# EAGLE design SeniorProjectBoard5 (EAGLE 8.3.2)
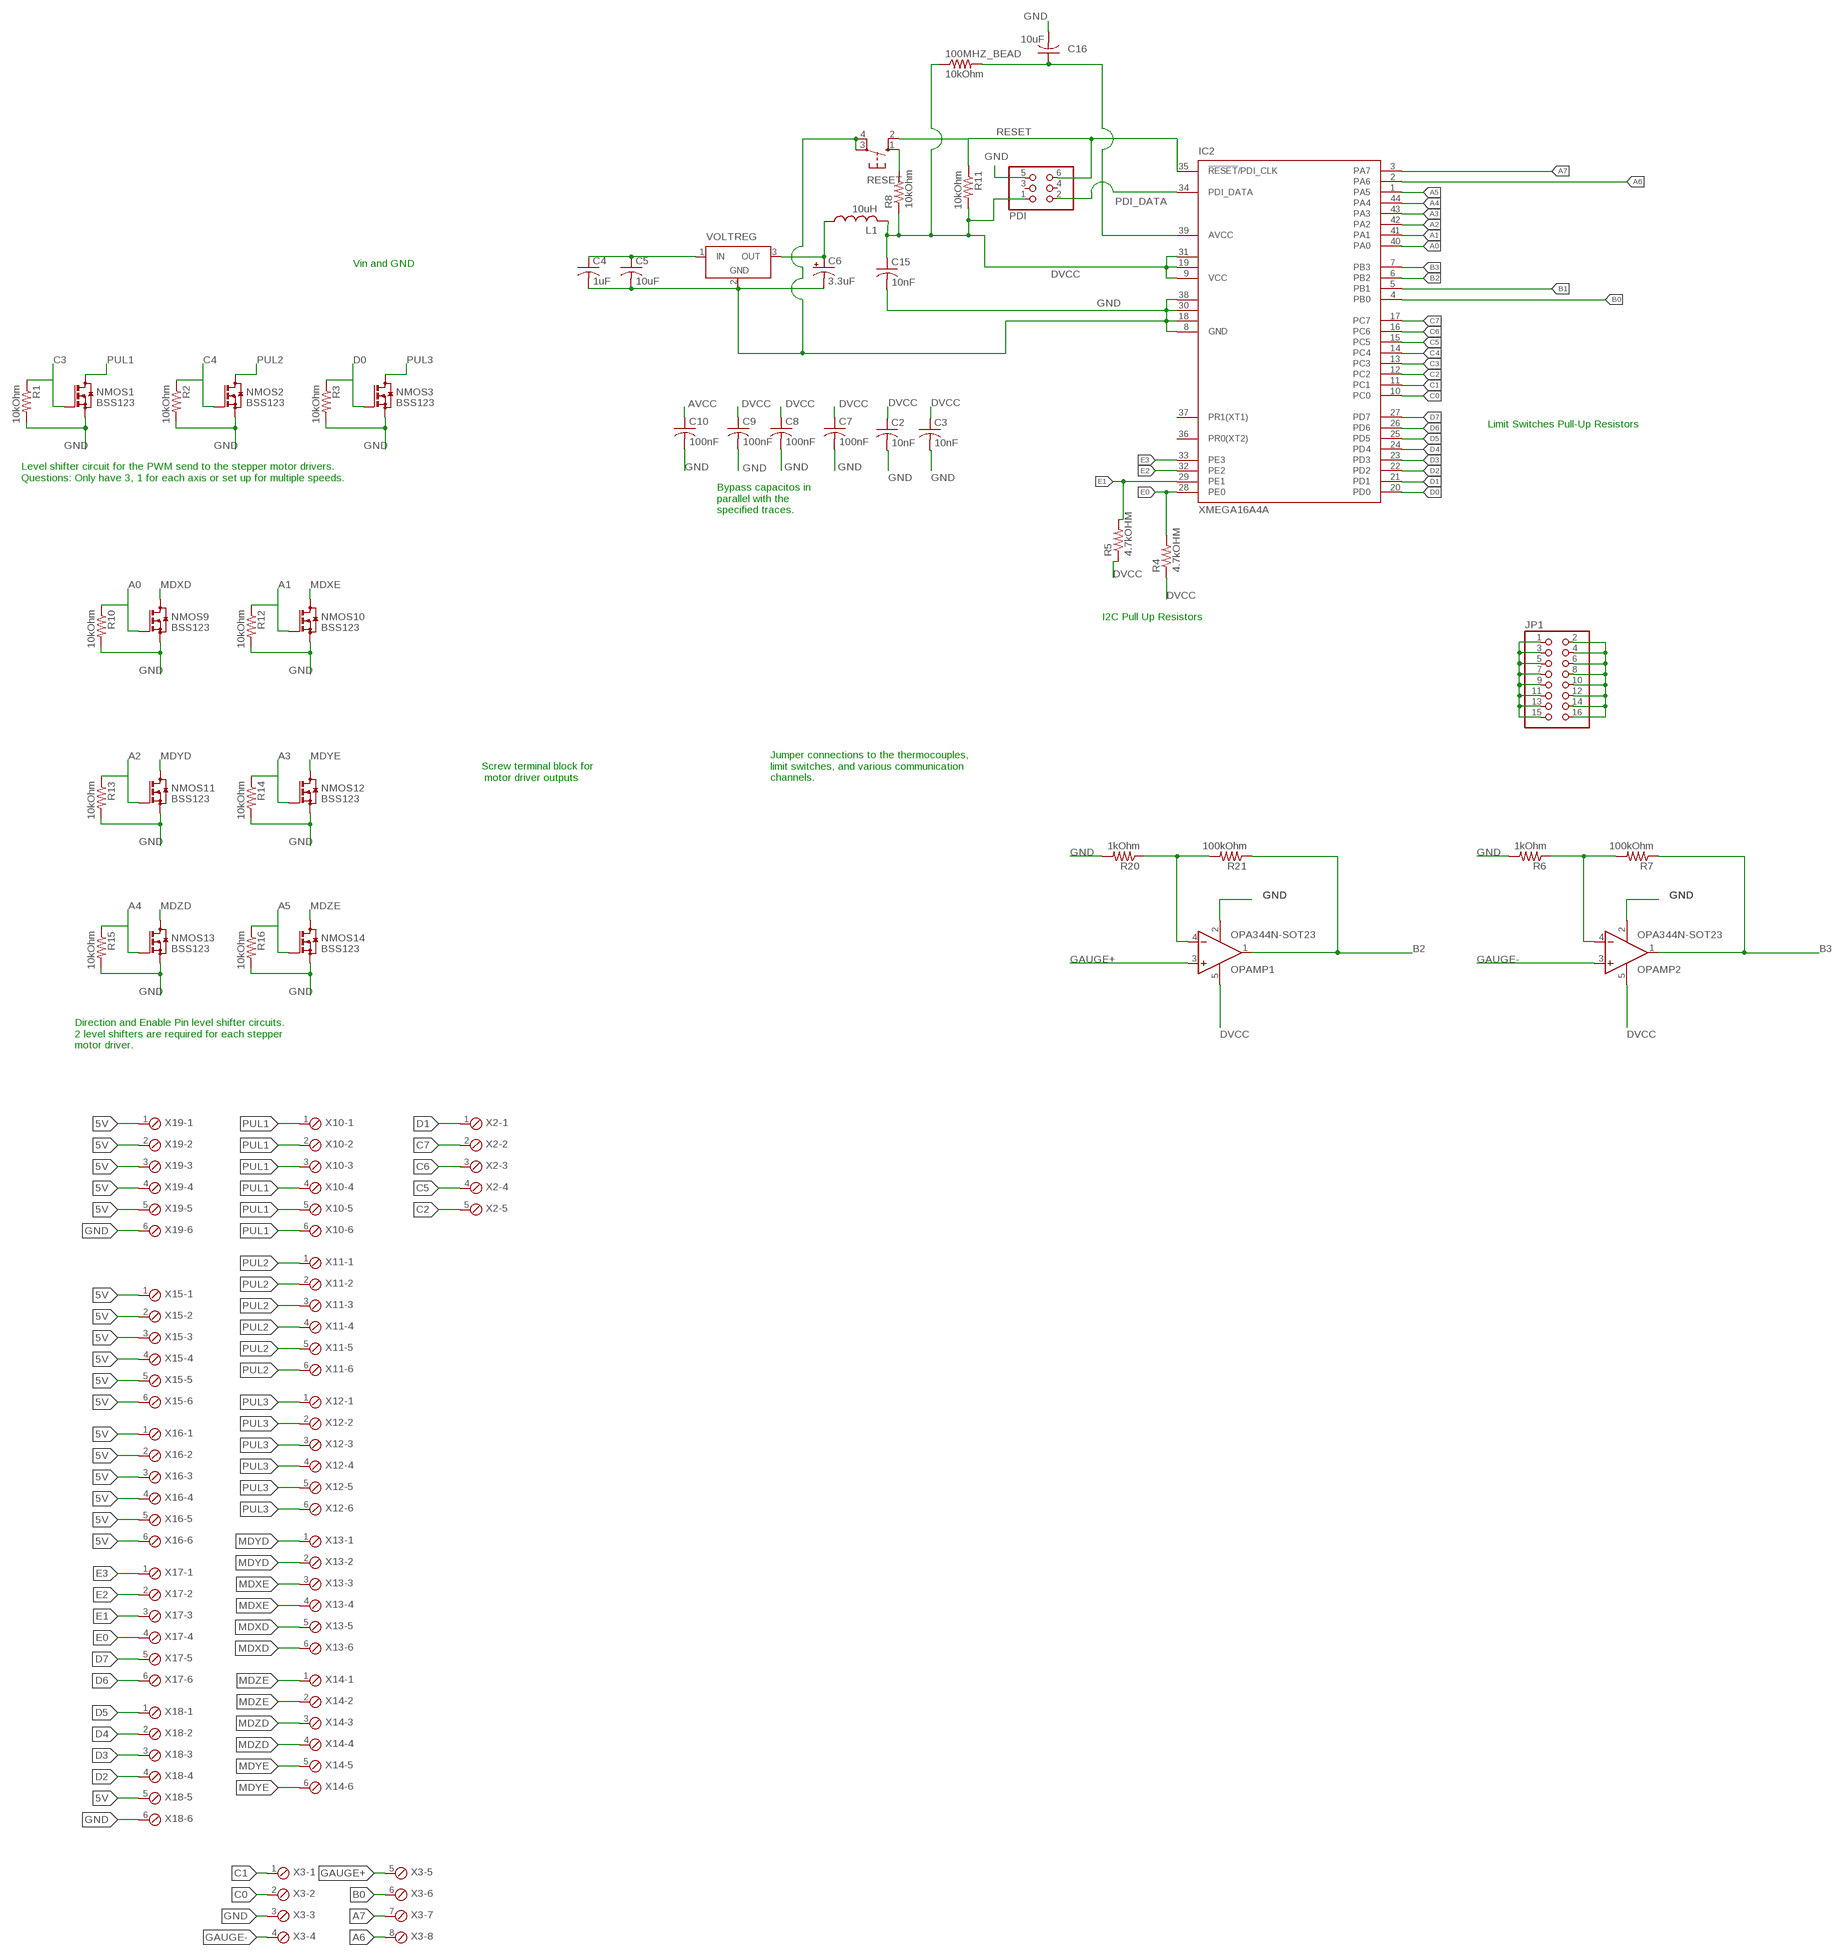
[diagram p0: schematic, sheet 1]

## Parts
100MHZ_BEAD  10kOhm  R-US_R0805  [R0805]
C2  10nF  C-USC0805  [C0805]
C3  10nF  C-USC0805  [C0805]
C4  1uF  C-USC0805  [C0805]
C5  10uF  C-USC0805  [C0805]
C6  3.3uF  CPOL-USCT3216  [CT3216]
C7  100nF  C-USC0805  [C0805]
C8  100nF  C-USC0805  [C0805]
C9  100nF  C-USC0805  [C0805]
C10  100nF  C-USC0805  [C0805]
C15  10nF  C-USC0805  [C0805]
C16  10uF  C-USC0805  [C0805]
IC2  XMEGA16A4A  [TQFP44]
JP1  PINHD-2X8  [2X08]
L1  10uH  L-USL1812  [L1812]
NMOS1  BSS123  [SOT23]
NMOS2  BSS123  [SOT23]
NMOS3  BSS123  [SOT23]
NMOS9  BSS123  [SOT23]
NMOS10  BSS123  [SOT23]
NMOS11  BSS123  [SOT23]
NMOS12  BSS123  [SOT23]
NMOS13  BSS123  [SOT23]
NMOS14  BSS123  [SOT23]
OPAMP1  OPA344N-SOT23  [SOT23-5]
OPAMP2  OPA344N-SOT23  [SOT23-5]
PDI  PINHD-2X3  [2X03]
R1  10kOhm  R-US_R0805  [R0805]
R2  10kOhm  R-US_R0805  [R0805]
R3  10kOhm  R-US_R0805  [R0805]
R4  4.7kOHM  R-US_R0805  [R0805]
R5  4.7kOHM  R-US_R0805  [R0805]
R6  1kOhm  R-US_R0805  [R0805]
R7  100kOhm  R-US_R0805  [R0805]
R8  10kOhm  R-US_R0805  [R0805]
R10  10kOhm  R-US_R0805  [R0805]
R11  10kOhm  R-US_R0805  [R0805]
R12  10kOhm  R-US_R0805  [R0805]
R13  10kOhm  R-US_R0805  [R0805]
R14  10kOhm  R-US_R0805  [R0805]
R15  10kOhm  R-US_R0805  [R0805]
R16  10kOhm  R-US_R0805  [R0805]
R20  1kOhm  R-US_R0805  [R0805]
R21  100kOhm  R-US_R0805  [R0805]
RESET  10-XX  [B3F-10XX]
VOLTREG  LT1129CST5  [SOT223]
X2  MPT5  [5POL254]
X3  MPT8  [8POL254]
X10  MPT6  [6POL254]
X11  MPT6  [6POL254]
X12  MPT6  [6POL254]
X13  MPT6  [6POL254]
X14  MPT6  [6POL254]
X15  MPT6  [6POL254]
X16  MPT6  [6POL254]
X17  MPT6  [6POL254]
X18  MPT6  [6POL254]
X19  MPT6  [6POL254]

## Nets
5V: C4.1 C5.1 VOLTREG.1(IN) X15.1 X15.2 X15.3 X15.4 X15.5 X15.6 X16.1 X16.2 X16.3 X16.4 X16.5 X16.6 X18.5 X19.1 X19.2 X19.3 X19.4 X19.5
A0: IC2.40(PA0) NMOS9.1(G) R10.1
A1: IC2.41(PA1) NMOS10.1(G) R12.1
A2: IC2.42(PA2) NMOS11.1(G) R13.1
A3: IC2.43(PA3) NMOS12.1(G) R14.1
A4: IC2.44(PA4) NMOS13.1(G) R15.1
A5: IC2.1(PA5) NMOS14.1(G) R16.1
A6: IC2.2(PA6) X3.8
A7: IC2.3(PA7) X3.7
AVCC: 100MHZ_BEAD.2 C10.1 C16.1 IC2.39(AVCC)
B0: IC2.4(PB0) X3.6
B1: IC2.5(PB1)
B2: IC2.6(PB2) OPAMP1.1(OUT) R21.1
B3: IC2.7(PB3) OPAMP2.1(OUT) R7.1
C0: IC2.10(PC0) X3.2
C1: IC2.11(PC1) X3.1
C2: IC2.12(PC2) X2.5
C3: IC2.13(PC3) NMOS1.1(G) R1.1
C4: IC2.14(PC4) NMOS2.1(G) R2.1
C5: IC2.15(PC5) X2.4
C6: IC2.16(PC6) X2.3
C7: IC2.17(PC7) X2.2
D0: IC2.20(PD0) NMOS3.1(G) R3.1
D1: IC2.21(PD1) X2.1
D2: IC2.22(PD2) X18.4
D3: IC2.23(PD3) X18.3
D4: IC2.24(PD4) X18.2
D5: IC2.25(PD5) X18.1
D6: IC2.26(PD6) X17.6
D7: IC2.27(PD7) X17.5
DVCC: 100MHZ_BEAD.1 C2.1 C3.1 C7.1 C8.1 C9.1 C15.1 IC2.9(VCC) IC2.19(VCC1) IC2.31(VCC2) JP1.1 JP1.3 JP1.5 JP1.7 JP1.9 JP1.11 JP1.13 JP1.15 L1.2 OPAMP1.5(V+) OPAMP2.5(V+) PDI.1 R4.1 R5.1 R8.1 R11.2
E0: IC2.28(PE0) R4.2 X17.4
E1: IC2.29(PE1) R5.2 X17.3
E2: IC2.32(PE2) X17.2
E3: IC2.33(PE3) X17.1
GAUGE+: OPAMP1.3(+IN) X3.5
GAUGE-: OPAMP2.3(+IN) X3.4
GND: C2.2 C3.2 C4.2 C5.2 C6.- C7.2 C8.2 C9.2 C10.2 C15.2 C16.2 IC2.8(GND) IC2.18(GND1) IC2.30(GND2) IC2.38(GND3) JP1.2 JP1.4 JP1.6 JP1.8 JP1.10 JP1.12 JP1.14 JP1.16 NMOS1.2(S) NMOS2.2(S) NMOS3.2(S) NMOS9.2(S) NMOS10.2(S) NMOS11.2(S) NMOS12.2(S) NMOS13.2(S) NMOS14.2(S) OPAMP1.2(V-) OPAMP2.2(V-) PDI.5 R1.2 R2.2 R3.2 R6.2 R10.2 R12.2 R13.2 R14.2 R15.2 R16.2 R20.2 RESET.3(P) RESET.4(P1) VOLTREG.2(GND) X3.3 X18.6 X19.6
MDXD: NMOS9.3(D) X13.5 X13.6
MDXE: NMOS10.3(D) X13.3 X13.4
MDYD: NMOS11.3(D) X13.1 X13.2
MDYE: NMOS12.3(D) X14.5 X14.6
MDZD: NMOS13.3(D) X14.3 X14.4
MDZE: NMOS14.3(D) X14.1 X14.2
N$1: OPAMP2.4(-IN) R6.1 R7.2
N$47: OPAMP1.4(-IN) R20.1 R21.2
PDI_DATA: IC2.34(PDI_DATA) PDI.2
PUL1: NMOS1.3(D) X10.1 X10.2 X10.3 X10.4 X10.5 X10.6
PUL2: NMOS2.3(D) X11.1 X11.2 X11.3 X11.4 X11.5 X11.6
PUL3: NMOS3.3(D) X12.1 X12.2 X12.3 X12.4 X12.5 X12.6
RESET: IC2.35(!RESET!/PDI_CLK) PDI.6 R11.1 RESET.2(S1)
SW_PULLUP: R8.2 RESET.1(S)
V_REG_OUT: C6.+ L1.1 VOLTREG.3(OUT)
Unconnected: IC2.36(PR0(XT2)) IC2.37(PR1(XT1)) PDI.3 PDI.4

## Notes on the sheet
- Vin and GND
- Limit Switches Pull-Up Resistors
- Level shifter circuit for the PWM send to the stepper motor drivers. 
  Questions: Only have 3, 1 for each axis or set up for multiple speeds.
- Bypass capacitos in
  parallel with the 
  specified traces.
- I2C Pull Up Resistors
- Screw terminal block for
   motor driver outputs
- Jumper connections to the thermocouples,
  limit switches, and various communication 
  channels.
- Direction and Enable Pin level shifter circuits.
  2 level shifters are required for each stepper
  motor driver.

## Power pins joined to a net without a drawn wire
GND: VOLTREG.4(GND)

## Library data of the parts
100MHZ_BEAD R1-R8 R10-R16 R20 R21 = rcl:R-US_: RESISTOR, American symbol
C2-C5 C7-C10 C15 C16 = rcl:C-US: CAPACITOR, American symbol
C6 = rcl:CPOL-US: POLARIZED CAPACITOR, American symbol
IC2 = atmel:XMEGA16A4: MICROCONTROLLER Features High-performance, Low-power 8/16-bit AVR XMEGA Microcontroller Non-Volatile Program and Data Memories - 16 KB - 128 KB of In-System Self-Programmable Flash - 4 KB - 8 KB Boot Code Section with Independent Lock Bits - 1 KB - 2 KB EEPROM - 2 KB - 8 KB Internal SRAM Peripheral Features - Four-channel DMA Controller with support for external requests - Eight-channel Event System - Five 16-bit Timer/Counters Three Timer/Counters with 4 Output Compare or Input Capture channels Two Timer/Counters with 2 Output Compare or Input Capture channels High-Resolution Extensions on all Timer/Counters Advanced Waveform Extension on one Timer/Counter - Five USARTs IrDA Extension on one USART - Two Two-Wire Interfaces with dual address match (I2C and SMBus compatible) - Two SPIs (Serial Peripheral Interfaces) peripherals - AES and DES Crypto Engine - 16-bit Real Time Counter with Separate Oscillator - One Twelve-channel, 12-bit, 2 Msps Analog to Digital Converter - One Two-channel, 12-bit, 1 Msps Digital to Analog Converter - Two Analog Comparators with Window compare function - External Interrupts on all General Purpose I/O pins - Programmable Watchdog Timer with Separate On-chip Ultra Low Power Oscillator Special Microcontroller Features - Power-on Reset and Programmable Brown-out Detection - Internal and External Clock Options with PLL - Programmable Multi-level Interrupt Controller - Sleep Modes: Idle, Power-down, Standby, Power-save, Extended Standby - Advanced Programming, Test and Debugging Interfaces PDI (Program and Debug Interface) for programming, test and debugging I/O and Packages - 34 Programmable I/O Lines - 44 - lead TQFP - 44 - pad VQFN/QFN - 49 - ball VFBGA Operating Voltage - 1.6 - 3.6V Speed performance - 0 - 12 MHz @ 1.6 - 3.6V - 0 - 32 MHz @ 2.7 - 3.6V Drawn by Dipl.-Ing. (FH) Robert Siegler Created: 27.05.09; OC_FARNELL: unknown; OC_NEWARK: unknown
JP1 = pinhead:PINHD-2X8: PIN HEADER
L1 = rcl:L-US: INDUCTOR, American symbol
NMOS1-NMOS3 NMOS9-NMOS14 = transistor-small-signal:BSS123: N-CHANNEL MOS FET
OPAMP1 OPAMP2 = linear:OPA*-SOT23: Single Operational Amplifier Low Power, Single-Supply, Rail-To-Rail Operational Amplifier Source: http://focus.ti.com/lit/ds/symlink/opa2345.pdf
PDI = pinhead:PINHD-2X3: PIN HEADER
RESET = switch-omron:10-XX: OMRON SWITCH; MPN: B3F-1000; OC_FARNELL: 176432; OC_NEWARK: 36M3542
VOLTREG = linear-technology:LT1129CST5: VOLTAGE REGULATOR with shutdown; MPN: LT1129CST-5#PBF; OC_FARNELL: 1663375; OC_NEWARK: 57M2069
X2 = con-phoenix-254:MPT5: PHOENIX CONNECTOR; OC_FARNELL: unknown; OC_NEWARK: unknown
X3 = con-phoenix-254:MPT8: PHOENIX CONNECTOR; OC_FARNELL: unknown; OC_NEWARK: unknown
X10-X19 = con-phoenix-254:MPT6: PHOENIX CONNECTOR; OC_FARNELL: unknown; OC_NEWARK: unknown

## Board
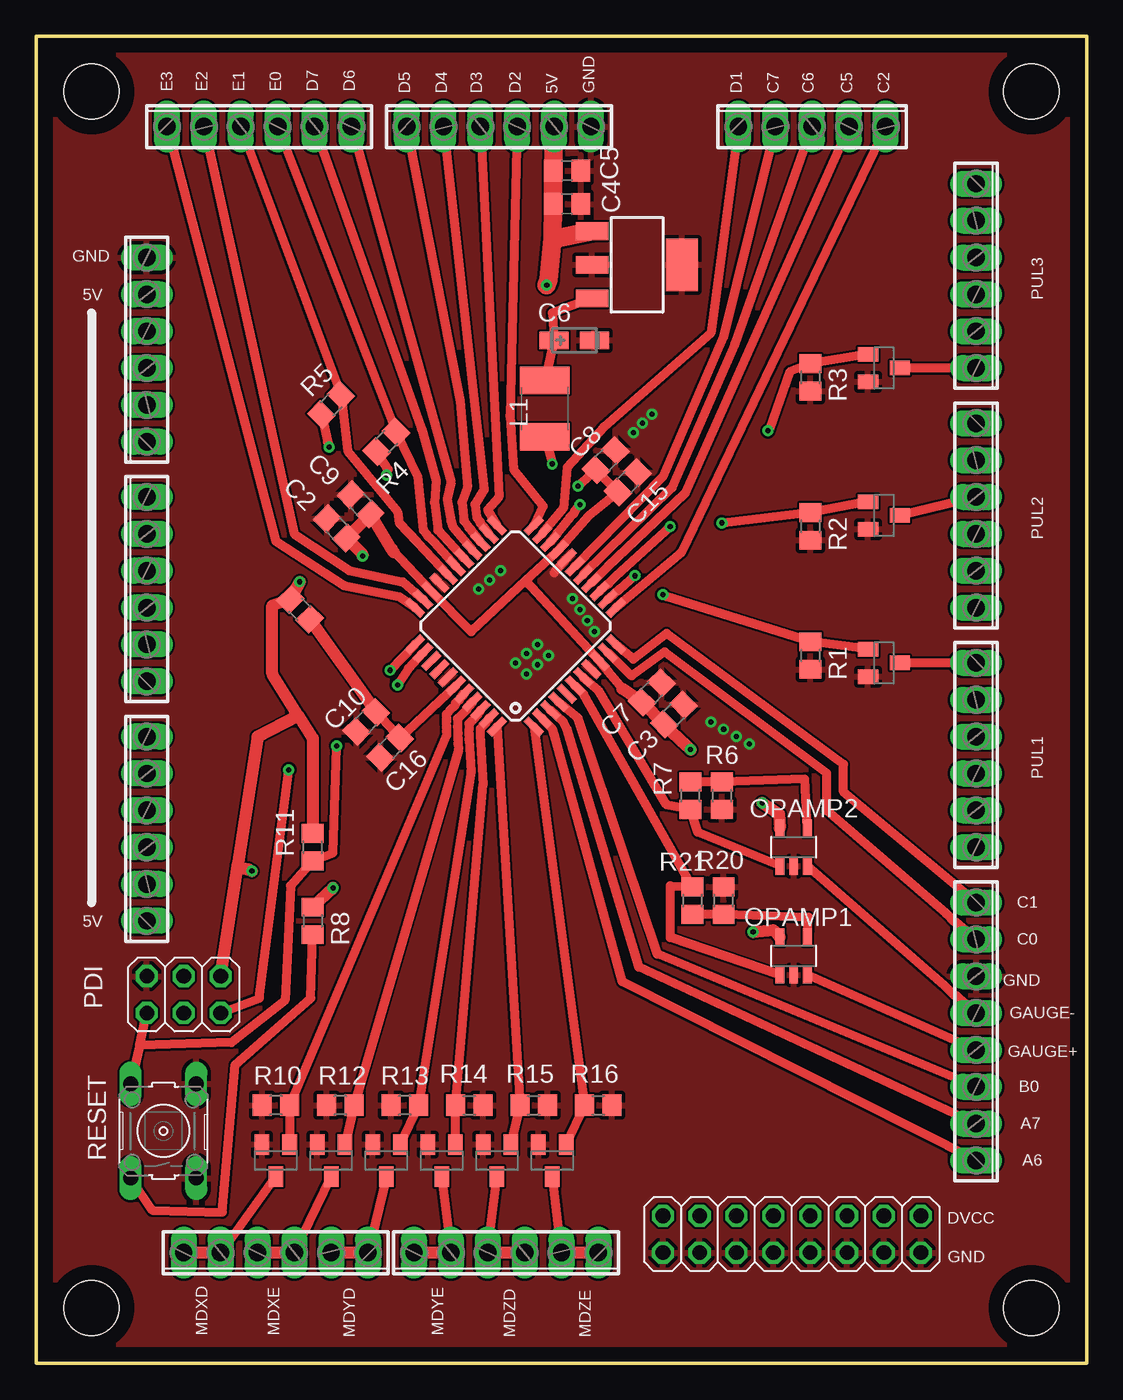
[diagram p1: board, top side]
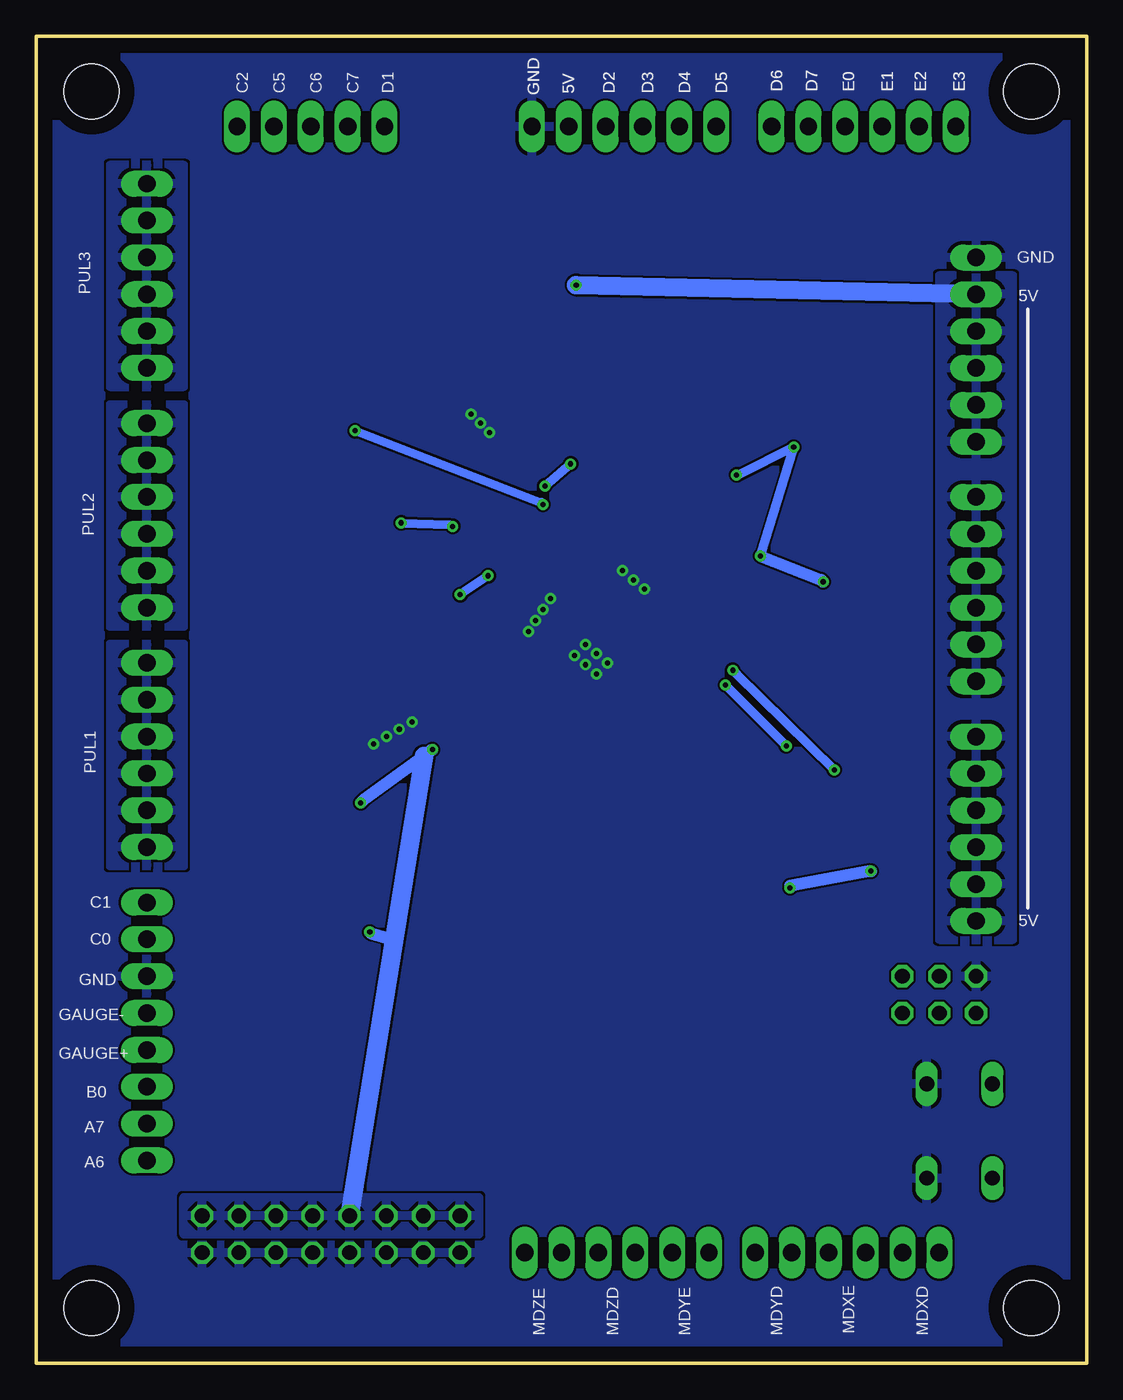
[diagram p2: board, bottom side, seen from below]

Size 72.39 x 91.44 mm. Coordinates in mm from the lower left corner, seen from the top.
Outline: 0,91.44 0,0 72.39,0 72.39,91.44 0,91.44
Copper layers (1*16): Top 0.035mm / dielectric 1.5mm / Bottom 0.035mm
Design rules "default": minimum track width 6mil, minimum drill 0.35mm, track to track 6mil, track to pad 6mil, pad to pad 6mil, via to via 6mil, smd to smd 6mil, copper to edge 40mil, drill to drill 6mil, minimum pad ring 10mil, minimum via ring 8mil, stop-mask expansion 4mil, vias tented up to drill 0mil, thermal gap 10mil
Holes 3.81 mm at 3.81,87.63 68.58,87.63 68.58,3.81 3.81,3.81

### Footprints (pad centres in the part's own frame; a part is rotated, then mirrored left to right if it is on the bottom)
R0805 = smd 1.3 x 1.5: 1 -0.95,0; 2 0.95,0
C0805 = smd 1.3 x 1.5: 1 -0.95,0; 2 0.95,0
CT3216 = smd 2 x 1.2: + -1.4,0; - 1.4,0
TQFP44 = smd 1.5 x 0.5: 1 -5.8,4; 2 -5.8,3.2; 3 -5.8,2.4; 4 -5.8,1.6; 5 -5.8,0.8; 6 -5.8,0; 7 -5.8,-0.8; 8 -5.8,-1.6; 9 -5.8,-2.4; 10 -5.8,-3.2; 11 -5.8,-4; 23 5.8,-4; 24 5.8,-3.2; 25 5.8,-2.4; 26 5.8,-1.6; 27 5.8,-0.8; 28 5.8,0; 29 5.8,0.8; 30 5.8,1.6; 31 5.8,2.4; 32 5.8,3.2; 33 5.8,4 | smd 0.5 x 1.5: 12 -4,-5.8; 13 -3.2,-5.8; 14 -2.4,-5.8; 15 -1.6,-5.8; 16 -0.8,-5.8; 17 0,-5.8; 18 0.8,-5.8; 19 1.6,-5.8; 20 2.4,-5.8; 21 3.2,-5.8; 22 4,-5.8; 34 4,5.8; 35 3.2,5.8; 36 2.4,5.8; 37 1.6,5.8; 38 0.8,5.8; 39 0,5.8; 40 -0.8,5.8; 41 -1.6,5.8; 42 -2.4,5.8; 43 -3.2,5.8; 44 -4,5.8
2X08 = drill 1.016 octagon: 1 -8.89,-1.27; 2 -8.89,1.27; 3 -6.35,-1.27; 4 -6.35,1.27; 5 -3.81,-1.27; 6 -3.81,1.27; 7 -1.27,-1.27; 8 -1.27,1.27; 9 1.27,-1.27; 10 1.27,1.27; 11 3.81,-1.27; 12 3.81,1.27; 13 6.35,-1.27; 14 6.35,1.27; 15 8.89,-1.27; 16 8.89,1.27
L1812 = smd 1.9 x 3.4: 1 -1.95,0; 2 1.95,0
SOT23 = smd 1 x 1.4: 1 -0.95,-1.1; 2 0.95,-1.1; 3 0,1.1
SOT23-5 = smd 0.6 x 1.2: 1 -0.95,-1.306; 2 0,-1.306; 3 0.95,-1.306; 4 0.95,1.306; 5 -0.95,1.306
2X03 = drill 1.016 octagon: 1 -2.54,-1.27; 2 -2.54,1.27; 3 0,-1.27; 4 0,1.27; 5 2.54,-1.27; 6 2.54,1.27
B3F-10XX = drill 1.016 long: 1 -3.251,2.261; 2 3.251,2.261; 3 -3.251,-2.261; 4 3.251,-2.261
SOT223 = smd 1.219 x 2.235: 1 -2.311,-3.099; 2 0,-3.099; 3 2.311,-3.099 | smd 3.6 x 2.2: 4 0,3.099
5POL254 = drill 1.2 long: 1 -5.08,0; 2 -2.54,0; 3 0,0; 4 2.54,0; 5 5.08,0
8POL254 = drill 1.2 long: 1 -8.89,0; 2 -6.35,0; 3 -3.81,0; 4 -1.27,0; 5 1.27,0; 6 3.81,0; 7 6.35,0; 8 8.89,0
6POL254 = drill 1.2 pad 1.778 long: 1 -6.35,0; 2 -3.81,0; 3 -1.27,0; 4 1.27,0; 5 3.81,0; 6 6.35,0

### Placement (x,y rotation side)
100MHZ_BEAD  18.16,51.94 315 top
C2  20.7,57.53 135 top
C3  43.94,44.7 45 top
C4  36.58,79.88 0 top
C5  36.58,82.17 0 top
C6  37.08,70.48 0 top
C7  42.42,46.23 45 top
C8  39.24,62.23 45 top
C9  22.35,59.18 135 top
C10  22.73,44.2 225 top
C15  40.77,60.71 45 top
C16  24.38,42.42 225 top
IC2  33.02,50.8 135 top
JP1  52.07,8.89 180 top
L1  35.05,65.79 270 top
NMOS1  58.42,48.26 270 top
NMOS2  58.42,58.42 270 top
NMOS3  58.42,68.58 270 top
NMOS9  16.51,13.97 180 top
NMOS10  20.32,13.97 180 top
NMOS11  24.13,13.97 180 top
NMOS12  27.94,13.97 180 top
NMOS13  31.75,13.97 180 top
NMOS14  35.56,13.97 180 top
OPAMP1  52.2,28.07 0 top
OPAMP2  52.2,35.56 0 top
PDI  10.16,25.4 180 top
R1  53.34,48.77 270 top
R2  53.34,57.66 270 top
R3  53.34,67.95 270 top
R4  24.13,63.5 45 top
R5  20.32,66.04 45 top
R6  47.24,39.12 270 top
R7  45.09,39.12 90 top
R8  19.05,30.48 270 top
R10  16.51,17.78 180 top
R11  19.05,35.56 90 top
R12  20.96,17.78 180 top
R13  25.4,17.78 180 top
R14  29.85,17.78 0 top
R15  34.29,17.78 0 top
R16  38.73,17.78 0 top
R20  47.37,31.88 90 top
R21  45.21,31.88 270 top
RESET  8.76,16 90 top
VOLTREG  41.4,75.69 270 top
X2  53.47,85.22 0 top
X3  64.77,22.86 270 top
X10  64.77,41.91 270 top
X11  64.77,58.42 270 top
X12  64.77,74.93 270 top
X13  16.51,7.62 180 top
X14  32.38,7.62 180 top
X15  7.62,36.83 90 top
X16  7.62,53.34 90 top
X17  15.37,85.22 0 top
X18  31.88,85.22 0 top
X19  7.62,69.85 90 top

### Tracks (layer width: path | path; a pad name or v marks a point on that pad's centre or on a via)
5V  (via drill 0.35)
  Top 1.27: 35.56,77.47 35.31,74.68 v35.18,74.3 | X18.5 C5.1 C4.1 35.56,77.47 | 35.56,77.47 VOLTREG.1
  Bottom 1.27: v35.18,74.3 X19.5
  pour Bottom: 5.08,74.93 10.16,74.93 10.16,29.21 5.08,29.21
A0
  Top 0.61: IC2.40 29.41,46.09 29.38,45.99 29.21,45.86 | 29.21,45.86 | 29.21,45.86 | 29.21,45.86 29.19,45.75 28.99,45.57 28.89,45.48 28.89,45.4 28.89,45.38 28.49,44.98 28.26,44.72 28.26,44.69 28.24,44.67 28.26,44.38 | 28.26,43.55 28.26,43.84 28.24,44.13 28.26,44.15 28.26,44.38 | 28.26,43.55 | 28.26,43.55 | 28.26,43.55 28.28,43.29 R10.1 NMOS9.1 | 28.26,44.38
A1
  Top 0.61: IC2.41 30.04,45.52 29.91,45.43 29.9,45.35 29.72,45.2 29.71,45.09 29.06,44.45 29.02,44.41 29.02,43.87 | 29.02,43.87 | 29.02,43.87 29.04,43.66 29.06,43.3 29.04,43.28 29.06,42.99 29.06,42.7 29.09,42.27 R12.1 NMOS10.1
A2
  Top 0.61: IC2.42 30.61,44.95 30.45,44.82 30.44,44.69 30.02,44.27 29.82,44.08 29.82,43.62 29.8,43.6 29.82,43.3 29.82,43.01 29.96,40.79 R13.1 NMOS11.1
A3
  Top 0.61: IC2.43 31.18,44.38 30.97,44.14 30.97,44.09 30.58,43.71 30.58,43.33 30.79,39.9 R14.1 NMOS12.1
A4
  Top 0.61: IC2.44 R15.1 NMOS13.1
A5
  Top 0.61: IC2.1 R16.1 NMOS14.1
A6
  Top 0.61: IC2.2 34.99,44.3 35.01,44.28 35.56,43.69 35.81,42.93 40.39,26.29 X3.8
A7
  Top 0.61: IC2.3 36.32,44.2 36.58,43.69 41.53,27.3 X3.7
AVCC
  Top 0.61: IC2.39 C16.1 C10.1
  Top 0.813: 100MHZ_BEAD.2 C10.1
B0
  Top 0.61: IC2.4 37.34,44.45 42.8,28.19 X3.6
B2
  Top 0.61: OPAMP1.1 43.69,29.34 43.69,32.89 R21.1 37.72,46.1 IC2.6
B3
  Top 0.61: OPAMP2.1 45.59,36.58 R7.1 43.43,38.48 38.73,46.35 IC2.7
C0
  Top 0.61: X3.2 63.4,30.39 63.31,30.39 62.71,30.99 54.48,38.1 54.48,40.64 43.31,49.02 41.02,47.37 IC2.10
C1
  Top 0.61: X3.1 55.63,39.37 55.63,41.27 43.43,50.29 41.15,48.51 IC2.11
C2
  Top 0.61: X2.5 44.45,55.88 IC2.12
C3  (via drill 0.35)
  Top 0.61: NMOS1.1 R1.1 43.43,52.83 v43.18,52.96 | v41.25,54.26 40.18,53.33 40.17,53.29 39.93,53.12 IC2.13
  Bottom 0.61: v43.18,52.96 41.27,54.23 v41.25,54.26
C4  (via drill 0.35)
  Top 0.61: NMOS2.1 R2.1 47.37,57.91 v47.24,57.91 | v43.69,57.66 39.9,54.19 39.52,53.83 | 39.52,53.83 39.47,53.77 39.46,53.72 | 39.52,53.83 IC2.14
  Bottom 0.61: v47.24,57.91 43.94,57.78 v43.69,57.66
C5
  Top 0.61: X2.4 44.7,59.94 39.37,54.88 IC2.15
C6
  Top 0.61: X2.3 48.13,70.23 43.81,60.32 IC2.16
C7
  Top 0.61: X2.2 47.37,70.74 43.18,61.09 IC2.17
D0  (via drill 0.35)
  Top 0.61: NMOS3.1 R3.1 51.94,68.33 50.55,64.39 v50.42,64.26 | v37.46,59.18 37.11,58.73 37.11,58.68 37.06,58.62 37.05,58.55 36.86,58.39 36.78,58.28 36.02,57.33 35.92,57.22 IC2.20
  Bottom 0.61: v50.42,64.26 37.59,59.31 v37.46,59.18
D1
  Top 0.61: X2.1 46.48,70.99 39.12,64.52 36.58,61.72 36.32,58.93 IC2.21
D2
  Top 0.61: X18.4 32.64,65.28 32.89,61.59 34.92,59.05 IC2.22
D3
  Top 0.61: X18.3 31.88,59.69 31.11,58.8 IC2.23
D4
  Top 0.61: X18.2 30.86,60.2 30.23,59.18 30.35,58.29 30.58,57.98 30.58,57.89 30.82,57.66 IC2.24
D5
  Top 0.61: X18.1 29.21,66.29 29.72,60.32 29.34,59.31 29.46,58.04 29.82,57.59 29.82,57.58 29.88,57.52 30.02,57.35 30.02,57.33 30.09,57.25 IC2.25
D6
  Top 0.61: X17.6 28.57,60.71 28.32,59.56 28.57,58.04 28.7,57.66 IC2.26
D7
  Top 0.61: X17.5 26.54,64.39 27.56,60.83 27.43,59.31 27.69,57.4 IC2.27
DVCC  (via drill 0.35)
  Top 0.61: v37.34,60.45 C8.1 C15.1 38.1,58.42 IC2.19 35.83,55.89 35.83,55.88 35.82,55.88 33.73,53.92 | L1.2 v35.56,61.98 | 33.73,53.92 29.97,50.42 IC2.31 24.5,56.11 | 33.73,53.92 IC2.9 39.41,47.67 39.42,47.67 39.42,47.66 40.39,46.48 | R5.1 20.07,63.5 v20.19,63.12 | v24.13,61.21 24.26,61.59 R4.1
  Top 0.813: 24.64,55.88 24.5,56.11 C9.1 C2.1 22.48,55.75 v22.48,55.63 | 18.06,44.63 16.26,47.5 16.26,52.2 100MHZ_BEAD.1 v18.16,53.85 | 18.06,44.63 19.05,43.05 R11.2 | 40.39,46.48 C7.1 C3.1 44.83,42.55 v45.09,42.29 | v50.04,38.61 51.18,37.85 OPAMP2.5 | v49.4,29.72 50.8,29.84 OPAMP1.5 | PDI.1 13.86,34.22 | 18.06,44.63 15.24,43.18 13.87,34.3 13.86,34.22 | 13.86,34.22 14.6,34.04 v14.86,33.91 | v20.45,32.77 R8.1
  Bottom 0.61: v35.56,61.98 v37.34,60.45 | v22.48,55.63 v20.19,63.12 24,61.21 v24.13,61.21
  Bottom 0.813: v22.48,55.63 18.29,53.98 v18.16,53.85 | v45.09,42.29 45.68,41.86 49.78,38.86 v50.04,38.61 | 47.74,29.13 49.28,29.59 v49.4,29.72 | v14.86,33.91 20.45,32.89 v20.45,32.77
  Bottom 1.27: 45.68,41.86 47.74,29.13 JP1.9
  pour Bottom: 41.91,11.43 41.91,8.89 62.23,8.89 62.23,11.43
E0
  Top 0.61: X17.4 R4.2 26.29,61.09 26.67,57.4 26.91,57.13 26.91,57.12 26.96,57.06 26.97,56.99 27.17,56.84 27.38,56.61 IC2.28
E1
  Top 0.61: X17.3 R5.2 21.46,62.87 24.89,58.67 25.02,57.91 26.26,56.58 26.28,56.56 IC2.29
E2
  Top 0.61: X17.2 17.78,57.15 21.59,54.61 25.27,53.85 IC2.32
E3
  Top 0.61: X17.1 16.51,56.64 21.21,53.59 25.02,52.83 IC2.33
GAUGE+
  Top 0.61: X3.5 OPAMP1.3
GAUGE-
  Top 0.61: X3.4 63.41,25.31 63.31,25.31 62.6,26.02 OPAMP2.3
GND  (via drill 0.35)
  Top 0.61: IC2.18 35.69,54.48
  other vias: 33.02,48.26 46.48,44.2 47.37,43.69 48.26,43.18 49.15,42.67 33.78,48.89 34.54,49.53 35.31,48.77 34.54,48.13 33.78,47.5 36.96,52.7 37.46,51.94 37.97,51.18 38.48,50.42 41.15,64.14 41.78,64.77 42.42,65.41 30.48,53.34 31.24,53.98 32,54.61
  pour Top (rank 6): -7.62,102.87 -7.62,-1.27 83.82,-1.27 83.82,102.87
  pour Bottom (rank 6): -7.62,102.87 -7.62,-1.27 83.82,-1.27 83.82,102.87
MDXD
  Top 0.61: NMOS9.3 X13.5
  Top 0.813: X13.5 X13.6
MDXE
  Top 0.61: NMOS10.3 X13.3
  Top 0.813: X13.3 X13.4
MDYD
  Top 0.61: NMOS11.3 X13.1
  Top 0.813: X13.1 X13.2
MDYE
  Top 0.61: NMOS12.3 X14.5
  Top 0.813: X14.5 X14.6
MDZD
  Top 0.61: X14.4 NMOS13.3
  Top 0.813: X14.3 X14.4
MDZE
  Top 0.61: X14.2 NMOS14.3
  Top 0.813: X14.1 X14.2
N$1
  Top 0.61: OPAMP2.4 52.96,40.26 R6.1 R7.2
N$47
  Top 0.61: OPAMP1.4 53.21,30.73 R20.1 R21.2
PDI_DATA  (via drill 0.35)
  Top 0.61: PDI.2 15.37,25.15 17.4,40.77 v17.4,40.89 | v24.38,47.75 IC2.34
  Bottom 0.61: v17.4,40.89 24.13,47.5 v24.38,47.75
PUL1
  Top 0.61: X10.1 NMOS1.3
  pour Bottom: 62.23,49.53 67.31,49.53 67.31,34.29 62.23,34.29
PUL2
  Top 0.61: X11.3 NMOS2.3
  pour Bottom: 62.23,66.04 67.31,66.04 67.31,50.8 62.23,50.8
PUL3
  Top 0.61: X12.6 NMOS3.3
  pour Bottom: 62.23,82.55 67.31,82.55 67.31,67.31 62.23,67.31
RESET  (via drill 0.35)
  Top 0.61: 7.11,21.9 RESET.2 | 7.11,21.9 PDI.6 | 7.11,21.9 13.46,22.1 17.14,25.02 17.53,32.89 R11.1 20.45,35.18 20.7,42.42 v20.7,42.55 | v24.89,46.74 25.65,47.88 IC2.35
  Bottom 0.61: v20.7,42.55 v24.89,46.74
SW_PULLUP
  Top 0.61: RESET.1 8,10.54 12.83,10.41 13.72,20.57 18.92,25.15 R8.2
V_REG_OUT
  Top 0.61: VOLTREG.3 35.56,72.39 C6.+ L1.1

### Text on the board
tPlace: E3 | E2 | E1 | E0 | D7 | D6 | D5 | D4 | D3 | D2 | 5V | GND | D1 | C7 | C6 | C5 | C2 | GND | PUL3 | 5V | PUL2 | PUL1 | C1 | 5V | C0 | GND | GAUGE- | GAUGE+ | B0 | A7 | A6 | DVCC | GND | MDXD | MDXE | MDYD | MDYE | MDZD | MDZE
bPlace: E3 | E3 | E2 | E2 | E1 | E1 | E0 | E0 | D7 | D7 | D6 | D6 | D5 | D5 | D4 | D4 | D3 | D3 | D2 | D2 | 5V | 5V | GND | GND | D1 | C7 | C6 | C5 | C2 | PUL3 | GND | 5V | PUL2 | PUL1 | C1 | 5V | C0 | GND | GAUGE- | GAUGE+ | B0 | A7 | A6 | MDXD | MDXE | MDYD | MDYE | MDZD | MDZE